# EAGLE design EasyCheck_rev2_interface (EAGLE 9.4.0)
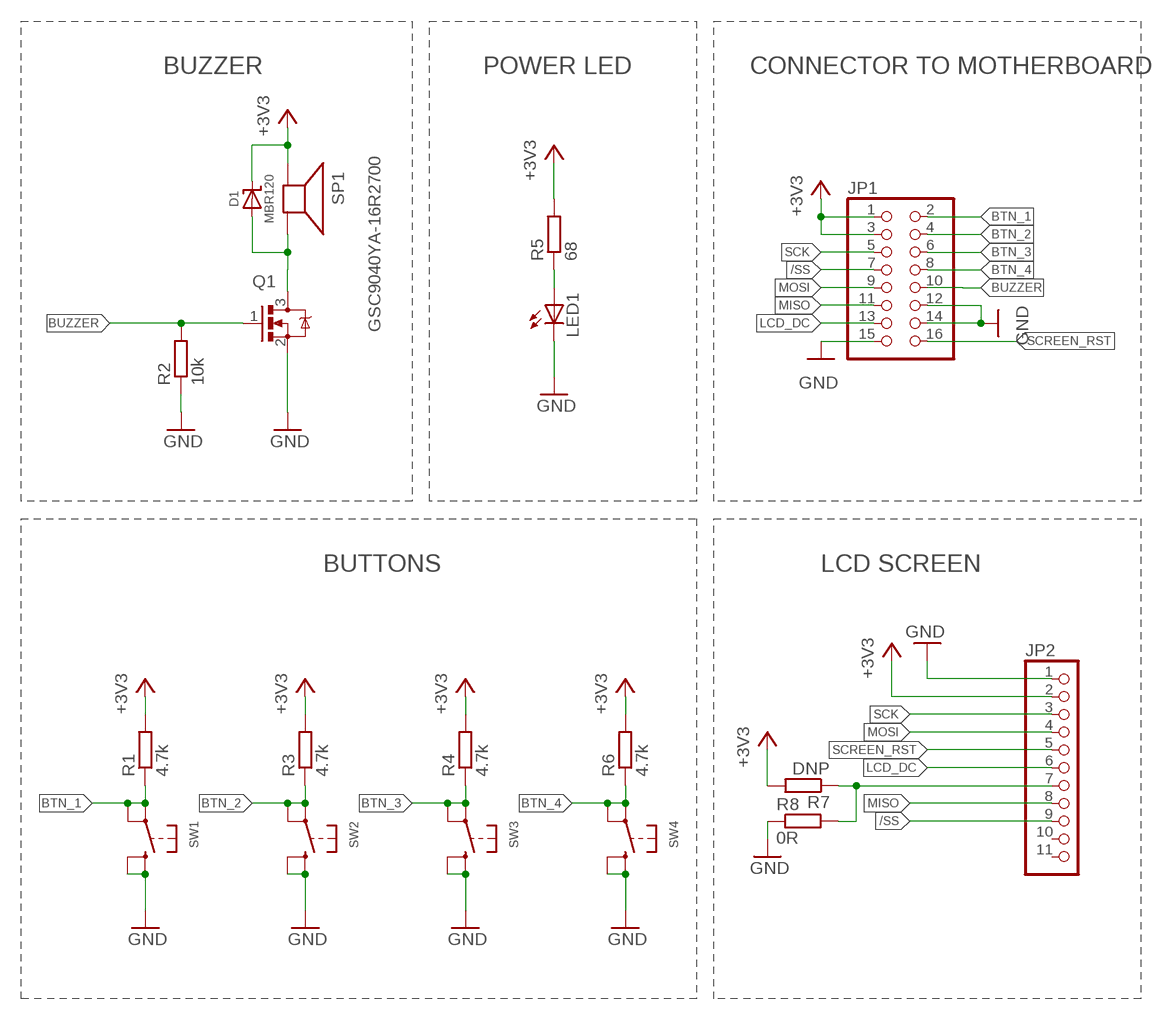
[diagram p0: schematic, sheet 1]

## Parts
D1  MBR120  MICROBUILDER_DIODE-SCHOTTKYSOD-123  [MICROBUILDER_SOD-123]
JP1  PINHD-2X8  [2X08]
JP2  PINHD-1X11  [1X11]
LED1  LEDCHIPLED_0603  [CHIPLED_0603]
Q1  DMN6140L  [SOT91P240X110-3N]
R1  4.7k  R-EU_R0603  [R0603]
R2  10k  R-EU_R0603  [R0603]
R3  4.7k  R-EU_R0603  [R0603]
R4  4.7k  R-EU_R0603  [R0603]
R5  68  R-EU_R0603  [R0603]
R6  4.7k  R-EU_R0603  [R0603]
R7  DNP  R-EU_R0603  [R0603]
R8  0R  R-EU_R0603  [R0603]
SP1  GSC9040YA-16R2700  [GSC9040YA-16R2700]
SW1  MICROBUILDER_SWITCH_TACT_SMT_EVQQ2_SMALL  [MICROBUILDER_EVQ-Q2_SMALLER]
SW2  MICROBUILDER_SWITCH_TACT_SMT_EVQQ2_SMALL  [MICROBUILDER_EVQ-Q2_SMALLER]
SW3  MICROBUILDER_SWITCH_TACT_SMT_EVQQ2_SMALL  [MICROBUILDER_EVQ-Q2_SMALLER]
SW4  MICROBUILDER_SWITCH_TACT_SMT_EVQQ2_SMALL  [MICROBUILDER_EVQ-Q2_SMALLER]

## Nets
+3V3: D1.C JP1.1 JP1.3 JP2.2 R1.2 R3.2 R4.2 R5.2 R6.2 R7.2 SP1.P$3(+)
/SS: JP1.7 JP2.9
BTN_1: JP1.2 R1.1 SW1.A'(P1) SW1.A(P)
BTN_2: JP1.4 R3.1 SW2.A'(P1) SW2.A(P)
BTN_3: JP1.6 R4.1 SW3.A'(P1) SW3.A(P)
BTN_4: JP1.8 R6.1 SW4.A'(P1) SW4.A(P)
BUZZER: JP1.10 Q1.1 R2.2
GND: JP1.12 JP1.14 JP1.15 JP2.1 LED1.C Q1.2 R2.1 R8.1 SW1.B'(S1) SW1.B(S) SW2.B'(S1) SW2.B(S) SW3.B'(S1) SW3.B(S) SW4.B'(S1) SW4.B(S)
LCD_DC: JP1.13 JP2.6
MISO: JP1.11 JP2.8
MOSI: JP1.9 JP2.4
N$1: JP2.7 R7.1 R8.2
N$2: D1.A Q1.3 SP1.P$2(-)
N$17: LED1.A R5.1
SCK: JP1.5 JP2.3
SCREEN_RST: JP1.16 JP2.5
Unconnected: JP2.10 JP2.11

## Notes on the sheet
- BUZZER | POWER LED | CONNECTOR TO MOTHERBOARD
- BUTTONS | LCD SCREEN

## Library data of the parts
D1 = Adafruit Feather M0 Basic rev C:MICROBUILDER_DIODE-SCHOTTKY
JP1 = pinhead:PINHD-2X8: PIN HEADER
JP2 = pinhead:PINHD-1X11: PIN HEADER
LED1 = led:LED: LED OSRAM: - CHIPLED LG R971, LG N971, LY N971, LG Q971, LY Q971, LO R971, LY R971 LH N974, LH R974 LS Q976, LO Q976, LY Q976 LO Q996 - Hyper CHIPLED LW Q18S LB Q993, LB Q99A, LB R99A - SideLED LS A670, LO A670, LY A670, LG A670, LP A670 LB A673, LV A673, LT A673, LW A673 LH A674 LY A675 LS A676, LA A676, LO A676, LY A676, LW A676 LS A679, LY A679, LG A679 - Hyper Micro SIDELED® LS Y876, LA Y876, LO Y876, LY Y876 LT Y87S - SmartLED LW L88C, LW L88S LB L89C, LB L89S, LG L890 LS L89K, LO L89K, LY L89K LS L896, LA L896, LO L896, LY L896 - TOPLED LS T670, LO T670, LY T670, LG T670, LP T670 LSG T670, LSP T670, LSY T670, LOP T670, LYG T670 LG T671, LOG T671, LSG T671 LB T673, LV T673, LT T673, LW T673 LH T674 LS T676, LA T676, LO T676, LY T676, LB T676, LH T676, LSB T676, LW T676 LB T67C, LV T67C, LT T67C, LS T67K, LO T67K, LY T67K, LW E67C LS E67B, LA E67B, LO E67B, LY E67B, LB E67C, LV E67C, LT E67C LW T67C LS T679, LY T679, LG T679 LS T770, LO T770, LY T770, LG T770, LP T770 LB T773, LV T773, LT T773, LW T773 LH T774 LS E675, LA E675, LY E675, LS T675 LS T776, LA T776, LO T776, LY T776, LB T776 LHGB T686 LT T68C, LB T68C - Hyper Mini TOPLED® LB M676 - Mini TOPLED Santana® LG M470 LS M47K, LO M47K, LY M47K Source: http://www.osram.convergy.de LUXEON: - LUMILED® LXK2-PW12-R00, LXK2-PW12-S00, LXK2-PW14-U00, LXK2-PW14-V00 LXK2-PM12-R00, LXK2-PM12-S00, LXK2-PM14-U00 LXK2-PE12-Q00, LXK2-PE12-R00, LXK2-PE12-S00, LXK2-PE14-T00, LXK2-PE14-U00 LXK2-PB12-K00, LXK2-PB12-L00, LXK2-PB12-M00, LXK2-PB14-N00, LXK2-PB14-P00, LXK2-PB14-Q00 LXK2-PR12-L00, LXK2-PR12-M00, LXK2-PR14-Q00, LXK2-PR14-R00 LXK2-PD12-Q00, LXK2-PD12-R00, LXK2-PD12-S00 LXK2-PH12-R00, LXK2-PH12-S00 LXK2-PL12-P00, LXK2-PL12-Q00, LXK2-PL12-R00 Source: www.luxeon.com KINGBRIGHT: KA-3528ASYC Source: www.kingbright.com
Q1 = DMN6140L:DMN6140L
R1-R8 = rcl:R-EU_: RESISTOR, European symbol; SPICEPREFIX: R
SP1 = EasyCheck:GSC9040YA-16R2700
SW1-SW4 = Adafruit HUZZAH32 ESP32 Feather:MICROBUILDER_SWITCH_TACT_SMT: SMT Tact Switches 6x6mm - Digikey: P12940SCT-ND KMR2 (4.6x2.8mm) - Digikey: 401-1426-1-ND EVQ-PQHB55 - Light Touch, 160GF (4.5x4.5mm) - Digikey: P8090SCT-ND KMT0 - KMT021 NGJ LHS (etc.) IP68/Waterproof - Digikey: CKN10289CT-ND

## Board
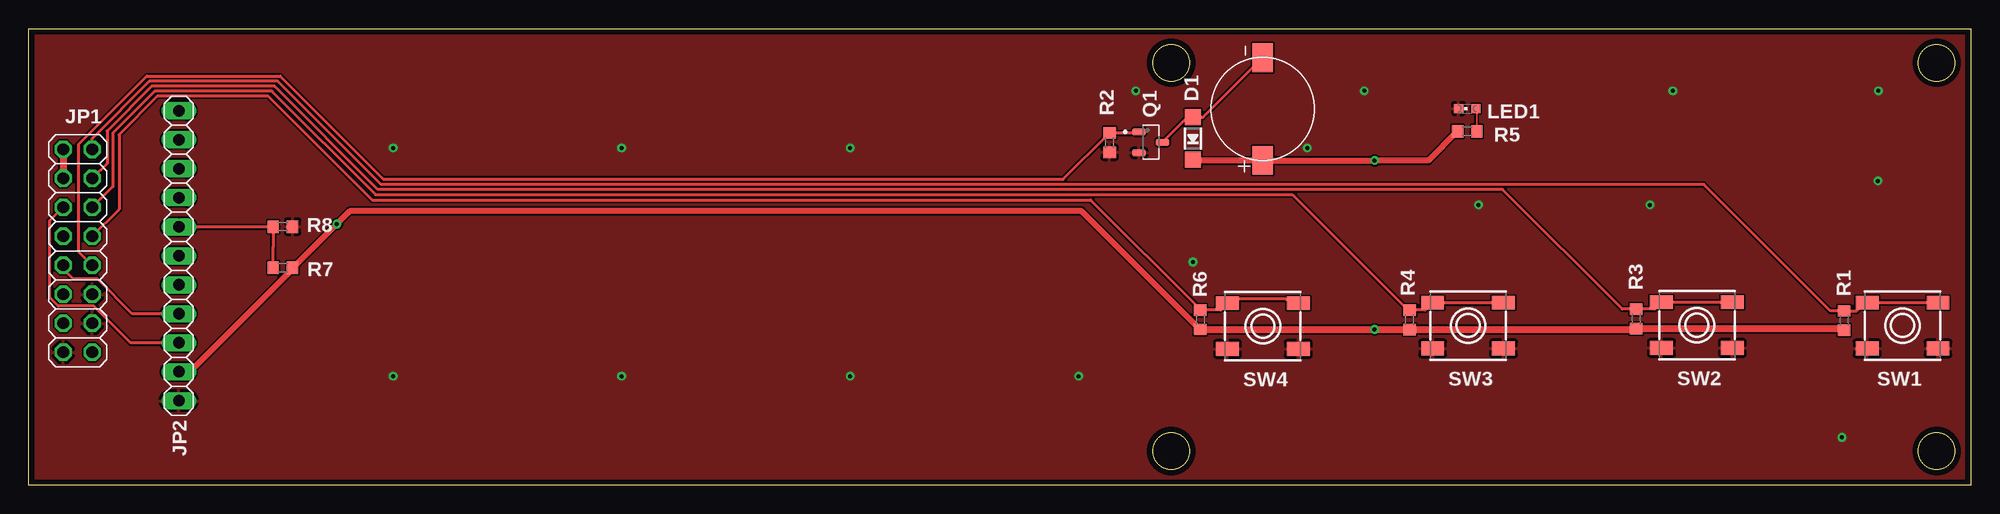
[diagram p1: board, top side]
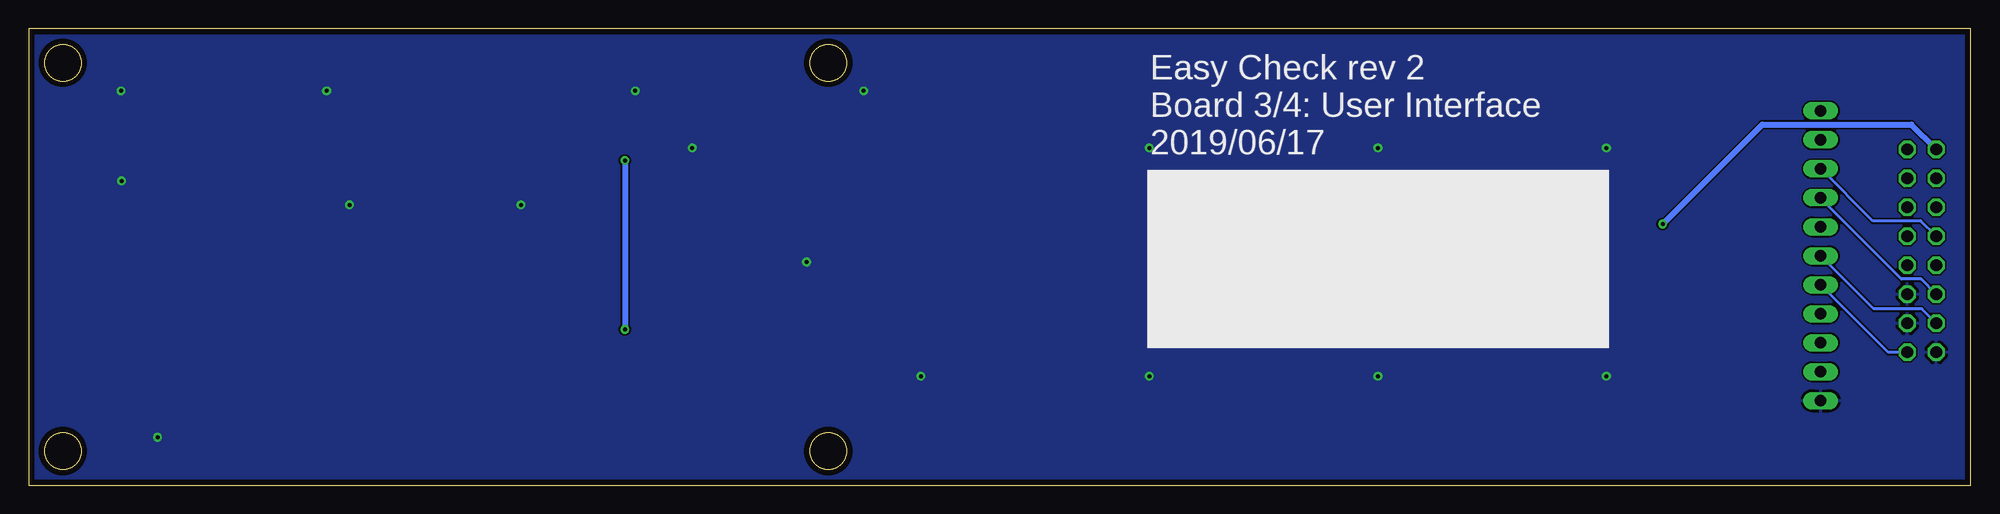
[diagram p2: board, bottom side, seen from below]

Size 170 x 40 mm. Coordinates in mm from the lower left corner, seen from the top.
Outline: 0,0 0,40
Outline: 0,40 170,40
Outline: 170,40 170,0
Outline: 170,0 0,0
Outline: 0,0 0,40
Outline: 0,40 170,40
Outline: 170,40 170,0
Outline: 170,0 0,0
Outline: 0,6.6 0,34.5
Outline: circle at 167,3 radius 1.6
Outline: circle at 100,37 radius 1.6
Outline: circle at 100,3 radius 1.6
Outline: circle at 167,37 radius 1.6
Outline: circle at 167,3 radius 1.6
Outline: circle at 100,37 radius 1.6
Outline: circle at 100,3 radius 1.6
Outline: circle at 167,37 radius 1.6
Copper layers (1*16): Top 0.035mm / dielectric 1.5mm / Bottom 0.035mm
Design rules "default": minimum track width 6mil, minimum drill 0.35mm, track to track 6mil, track to pad 6mil, pad to pad 6mil, via to via 6mil, smd to smd 6mil, copper to edge 20mil, drill to drill 6mil, minimum pad ring 10mil, minimum via ring 8mil, stop-mask expansion 4mil, vias tented up to drill 0.4mm, thermal gap 10mil

### Footprints (pad centres in the part's own frame; a part is rotated, then mirrored left to right if it is on the bottom)
MICROBUILDER_SOD-123 = smd 1.4 x 1.4: A 1.85,0; C -1.85,0
2X08 = drill 1.016 octagon: 1 -8.89,-1.27; 2 -8.89,1.27; 3 -6.35,-1.27; 4 -6.35,1.27; 5 -3.81,-1.27; 6 -3.81,1.27; 7 -1.27,-1.27; 8 -1.27,1.27; 9 1.27,-1.27; 10 1.27,1.27; 11 3.81,-1.27; 12 3.81,1.27; 13 6.35,-1.27; 14 6.35,1.27; 15 8.89,-1.27; 16 8.89,1.27
1X11 = drill 1.016 long: 1 -12.7,0; 2 -10.16,0; 3 -7.62,0; 4 -5.08,0; 5 -2.54,0; 6 0,0; 7 2.54,0; 8 5.08,0; 9 7.62,0; 10 10.16,0; 11 12.7,0
CHIPLED_0603 = smd 0.8 x 0.8: A 0,-0.75; C 0,0.75
SOT91P240X110-3N = smd 1.18 x 0.61: 1 -1.025,0.915; 2 -1.025,-0.915; 3 1.025,0
R0603 = smd 1 x 1.1: 1 -0.85,0; 2 0.85,0
GSC9040YA-16R2700 = smd 1.8 x 2.5: P$2 0,4.5; P$3 0,-4.5
MICROBUILDER_EVQ-Q2_SMALLER = smd 2 x 1.2: A -3.1,-2; A' 3.1,-2; B -3.1,2; B' 3.1,2

### Placement (x,y rotation side)
D1  101.91,30.38 90 top
JP1  4.3,20.54 270 top
JP2  13.16,20.1 90 top
LED1  125.91,33 90 top
Q1  98.22,30.05 0 top
R1  158.91,14.42 270 top
R2  94.61,30.01 90 top
R3  140.71,14.58 270 top
R4  120.86,14.49 270 top
R5  125.91,31 180 top
R6  102.56,14.5 270 top
R7  22.26,19.05 0 top
R8  22.26,22.65 180 top
SP1  108.01,32.95 0 top
SW1  164.02,13.99 180 top
SW2  146.01,14.02 180 top
SW3  125.99,13.99 180 top
SW4  108.03,13.94 180 top

### Tracks (layer width: path | path; a pad name or v marks a point on that pad's centre or on a via)
+3V3  (via drill 0.35)
  Top 0.254: R7.2 23.13,19.02 | 13.16,10 JP2.2 13.21,9.99
  Top 0.508: R6.2 102.51,13.65 92.16,24 28.11,24 v26.98,22.87 23.13,19.02 | R7.2 23.11,18.95 14.15,9.99 13.21,9.99 | R5.2 122.51,28.45 v117.81,28.45 SP1.P$3 101.99,28.45 D1.C
  Top 0.61: JP1.1 JP1.3 | R6.2 v117.81,13.65 R4.2 140.62,13.64 R3.2 158.75,13.73 R1.2
  Bottom 0.508: v117.81,28.45 v117.81,13.65 | JP1.1 5.2,31.6 18.26,31.6 v26.98,22.87
/SS
  Bottom 0.254: JP1.7 4.37,23.15 8.59,23.15 JP2.9
BTN_1
  Top 0.254: JP1.2 5.57,30.38 10.57,35.38 21.82,35.38 30.85,26.35 146.63,26.35 157.71,15.27 R1.1 160.01,15.27 160.73,15.99 SW1.A' SW1.A
BTN_2
  Top 0.254: JP1.4 6.87,28.19 6.87,31.04 10.77,34.94 21.52,34.94 30.56,25.9 129.01,25.9 139.48,15.43 R3.1 142.32,15.43 SW2.A' SW2.A
BTN_3
  Top 0.254: JP1.6 7.37,26.15 7.37,30.85 11.05,34.52 21.3,34.52 30.37,25.45 110.61,25.45 120.72,15.34 R4.1 122.24,15.34 SW3.A' SW3.A
BTN_4
  Top 0.254: JP1.8 7.92,24.16 7.92,30.71 11.32,34.11 20.94,34.11 30.06,24.99 92.96,24.99 102.56,15.39 R6.1 104.33,15.34 SW4.A' 105.33,16.34 110.01,16.34 110.73,16.34 | 111.16,15.97 SW4.A | 110.73,16.34 SW4.A | 110.73,16.34 SW4.A
BUZZER
  Top 0.254: Q1.1 97.09,30.86 R2.2 90.55,26.8 31.05,26.8 22.02,35.83 10.34,35.83 4.36,29.85 4.36,20.48 JP1.10
GND  (via drill 0.35)
  other vias: 158.71,4.2 161.86,26.65 161.91,34.55 141.91,24.55 126.91,24.55 116.91,34.55 101.91,19.55 96.91,34.55 111.91,29.55 71.91,29.55 51.91,29.55 31.91,29.55 51.91,9.55 31.91,9.55 71.91,9.55 91.91,9.55 143.91,34.55
  pour Top: -1.39,41.3 170.81,41.3 170.81,-1.35 -1.39,-1.35
  pour Bottom: -0.94,41.05 171.21,41.05 171.21,-2 -0.94,-2
LCD_DC
  Bottom 0.254: JP1.13 4.29,15.45 8.51,15.45 JP2.6
MISO
  Bottom 0.254: JP1.11 4.35,18.05 6.08,18.05 13.16,25.12 JP2.8
MOSI
  Top 0.254: JP2.4 9.09,15.02 6.06,18.05 3.91,18.05 3.03,18.92 JP1.9
N$1
  Top 0.254: R7.1 21.41,20.75 21.41,20.89 21.41,22.6 | R8.2 21.41,22.6 | JP2.7 13.2,22.6 21.41,22.6
N$2
  Top 0.254: SP1.P$2 102.79,32.23 102.36,32.23 | D1.A 102.36,32.23 | Q1.3 101.42,32.23 102.36,32.23
N$17
  Top 0.152: R5.1 126.76,32.9 LED1.A
SCK
  Top 0.254: JP2.3 8.93,12.48 5.72,15.69 2.6,15.69 1.99,16.3 1.99,16.31 1.86,16.45 1.86,23.17 JP1.5
  Bottom 0.254: 11.86,12.48 JP2.3
SCREEN_RST
  Bottom 0.254: JP1.16 7.25,11.65 JP2.5

### Text on the board
bPlace: Easy Check rev 2 / Board 3/4: User Interface / 2019/06/17